# EAGLE design cupcake-heater-board (EAGLE 5.07)
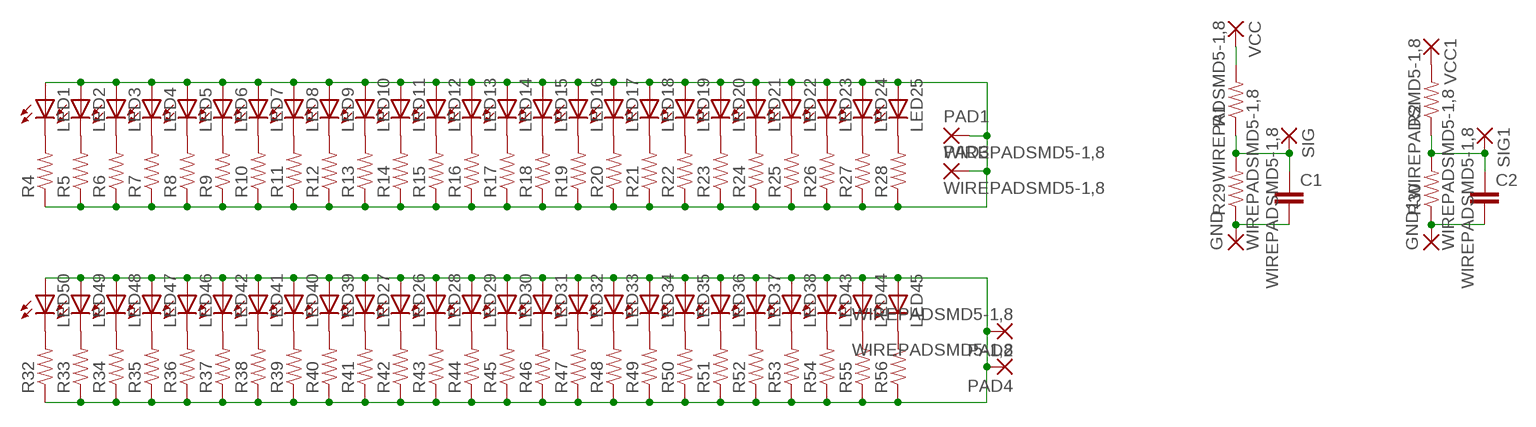
[diagram p0: schematic, sheet 1]

## Parts
C1  C-EUC1206  [C1206]
C2  C-EUC1206  [C1206]
GND  WIREPADSMD5-1,8  [5-1,8]
GND1  WIREPADSMD5-1,8  [5-1,8]
LED1  LED1206  [LED-1206]
LED2  LED1206  [LED-1206]
LED3  LED1206  [LED-1206]
LED4  LED1206  [LED-1206]
LED5  LED1206  [LED-1206]
LED6  LED1206  [LED-1206]
LED7  LED1206  [LED-1206]
LED8  LED1206  [LED-1206]
LED9  LED1206  [LED-1206]
LED10  LED1206  [LED-1206]
LED11  LED1206  [LED-1206]
LED12  LED1206  [LED-1206]
LED13  LED1206  [LED-1206]
LED14  LED1206  [LED-1206]
LED15  LED1206  [LED-1206]
LED16  LED1206  [LED-1206]
LED17  LED1206  [LED-1206]
LED18  LED1206  [LED-1206]
LED19  LED1206  [LED-1206]
LED20  LED1206  [LED-1206]
LED21  LED1206  [LED-1206]
LED22  LED1206  [LED-1206]
LED23  LED1206  [LED-1206]
LED24  LED1206  [LED-1206]
LED25  LED1206  [LED-1206]
LED26  LED1206  [LED-1206]
LED27  LED1206  [LED-1206]
LED28  LED1206  [LED-1206]
LED29  LED1206  [LED-1206]
LED30  LED1206  [LED-1206]
LED31  LED1206  [LED-1206]
LED32  LED1206  [LED-1206]
LED33  LED1206  [LED-1206]
LED34  LED1206  [LED-1206]
LED35  LED1206  [LED-1206]
LED36  LED1206  [LED-1206]
LED37  LED1206  [LED-1206]
LED38  LED1206  [LED-1206]
LED39  LED1206  [LED-1206]
LED40  LED1206  [LED-1206]
LED41  LED1206  [LED-1206]
LED42  LED1206  [LED-1206]
LED43  LED1206  [LED-1206]
LED44  LED1206  [LED-1206]
LED45  LED1206  [LED-1206]
LED46  LED1206  [LED-1206]
LED47  LED1206  [LED-1206]
LED48  LED1206  [LED-1206]
LED49  LED1206  [LED-1206]
LED50  LED1206  [LED-1206]
PAD1  WIREPADSMD5-1,8  [5-1,8]
PAD2  WIREPADSMD5-1,8  [5-1,8]
PAD3  WIREPADSMD5-1,8  [5-1,8]
PAD4  WIREPADSMD5-1,8  [5-1,8]
R1  RESISTOR1206  [1206]
R2  RESISTOR1206  [1206]
R4  RESISTOR1206  [1206]
R5  RESISTOR1206  [1206]
R6  RESISTOR1206  [1206]
R7  RESISTOR1206  [1206]
R8  RESISTOR1206  [1206]
R9  RESISTOR1206  [1206]
R10  RESISTOR1206  [1206]
R11  RESISTOR1206  [1206]
R12  RESISTOR1206  [1206]
R13  RESISTOR1206  [1206]
R14  RESISTOR1206  [1206]
R15  RESISTOR1206  [1206]
R16  RESISTOR1206  [1206]
R17  RESISTOR1206  [1206]
R18  RESISTOR1206  [1206]
R19  RESISTOR1206  [1206]
R20  RESISTOR1206  [1206]
R21  RESISTOR1206  [1206]
R22  RESISTOR1206  [1206]
R23  RESISTOR1206  [1206]
R24  RESISTOR1206  [1206]
R25  RESISTOR1206  [1206]
R26  RESISTOR1206  [1206]
R27  RESISTOR1206  [1206]
R28  RESISTOR1206  [1206]
R29  RESISTOR1206  [1206]
R30  RESISTOR1206  [1206]
R32  RESISTOR1206  [1206]
R33  RESISTOR1206  [1206]
R34  RESISTOR1206  [1206]
R35  RESISTOR1206  [1206]
R36  RESISTOR1206  [1206]
R37  RESISTOR1206  [1206]
R38  RESISTOR1206  [1206]
R39  RESISTOR1206  [1206]
R40  RESISTOR1206  [1206]
R41  RESISTOR1206  [1206]
R42  RESISTOR1206  [1206]
R43  RESISTOR1206  [1206]
R44  RESISTOR1206  [1206]
R45  RESISTOR1206  [1206]
R46  RESISTOR1206  [1206]
R47  RESISTOR1206  [1206]
R48  RESISTOR1206  [1206]
R49  RESISTOR1206  [1206]
R50  RESISTOR1206  [1206]
R51  RESISTOR1206  [1206]
R52  RESISTOR1206  [1206]
R53  RESISTOR1206  [1206]
R54  RESISTOR1206  [1206]
R55  RESISTOR1206  [1206]
R56  RESISTOR1206  [1206]
SIG  WIREPADSMD5-1,8  [5-1,8]
SIG1  WIREPADSMD5-1,8  [5-1,8]
VCC  WIREPADSMD5-1,8  [5-1,8]
VCC1  WIREPADSMD5-1,8  [5-1,8]

## Nets
N$2: LED1.C R4.2
N$3: C1.2 GND.1(P) R29.1
N$4: C1.1 R1.1 R29.2 SIG.1(P)
N$5: C2.1 R2.1 R30.2 SIG1.1(P)
N$6: C2.2 GND1.1(P) R30.1
N$7: R2.2 VCC1.1(P)
N$8: R1.2 VCC.1(P)
N$12: LED2.C R5.2
N$13: LED3.C R6.2
N$14: LED4.C R7.2
N$15: LED5.C R8.2
N$16: LED6.C R9.2
N$17: LED7.C R10.2
N$18: LED8.C R11.2
N$19: LED9.C R12.2
N$20: LED10.C R13.2
N$21: LED11.C R14.2
N$22: LED50.C R32.2
N$23: LED12.C R15.2
N$24: LED13.C R16.2
N$25: LED14.C R17.2
N$26: LED15.C R18.2
N$27: LED16.C R19.2
N$28: LED17.C R20.2
N$29: LED18.C R21.2
N$30: LED19.C R22.2
N$31: LED20.C R23.2
N$32: LED21.C R24.2
N$33: LED22.C R25.2
N$34: LED23.C R26.2
N$35: LED24.C R27.2
N$36: LED25.C R28.2
N$37: LED1.A LED2.A LED3.A LED4.A LED5.A LED6.A LED7.A LED8.A LED9.A LED10.A LED11.A LED12.A LED13.A LED14.A LED15.A LED16.A LED17.A LED18.A LED19.A LED20.A LED21.A LED22.A LED23.A LED24.A LED25.A PAD1.1(P) PAD3.1(P) R4.1 R5.1 R6.1 R7.1 R8.1 R9.1 R10.1 R11.1 R12.1 R13.1 R14.1 R15.1 R16.1 R17.1 R18.1 R19.1 R20.1 R21.1 R22.1 R23.1 R24.1 R25.1 R26.1 R27.1 R28.1
N$38: LED49.C R33.2
N$39: LED48.C R34.2
N$40: LED47.C R35.2
N$41: LED46.C R36.2
N$42: LED42.C R37.2
N$43: LED41.C R38.2
N$44: LED40.C R39.2
N$45: LED39.C R40.2
N$46: LED27.C R41.2
N$47: LED26.C R42.2
N$48: LED28.C R43.2
N$49: LED29.C R44.2
N$50: LED30.C R45.2
N$51: LED31.C R46.2
N$52: LED32.C R47.2
N$53: LED33.C R48.2
N$54: LED34.C R49.2
N$55: LED35.C R50.2
N$56: LED36.C R51.2
N$57: LED37.C R52.2
N$58: LED38.C R53.2
N$59: LED43.C R54.2
N$60: LED44.C R55.2
N$61: LED45.C R56.2
N$62: LED26.A LED27.A LED28.A LED29.A LED30.A LED31.A LED32.A LED33.A LED34.A LED35.A LED36.A LED37.A LED38.A LED39.A LED40.A LED41.A LED42.A LED43.A LED44.A LED45.A LED46.A LED47.A LED48.A LED49.A LED50.A PAD2.1(P) PAD4.1(P) R32.1 R33.1 R34.1 R35.1 R36.1 R37.1 R38.1 R39.1 R40.1 R41.1 R42.1 R43.1 R44.1 R45.1 R46.1 R47.1 R48.1 R49.1 R50.1 R51.1 R52.1 R53.1 R54.1 R55.1 R56.1

## Library data of the parts
C1 C2 = resistor:C-EU: CAPACITOR, European symbol
GND GND1 PAD1-PAD4 SIG SIG1 VCC VCC1 = wirepad:WIREPAD: Wire PAD connect wire on PCB
LED1-LED50 = SparkFun:LED: LEDs Standard schematic elements and footprints for 5mm, 3mm, 1206, and 0603 sized LEDs. 5mm - Spark Fun Electronics SKU : COM-00529 (and others)
R1 R2 R4-R30 R32-R56 = SparkFun:RESISTOR: Resistor Basic schematic elements and footprints for 0603, 1206, and PTH 1/10th watt (small) resistors.

## Board
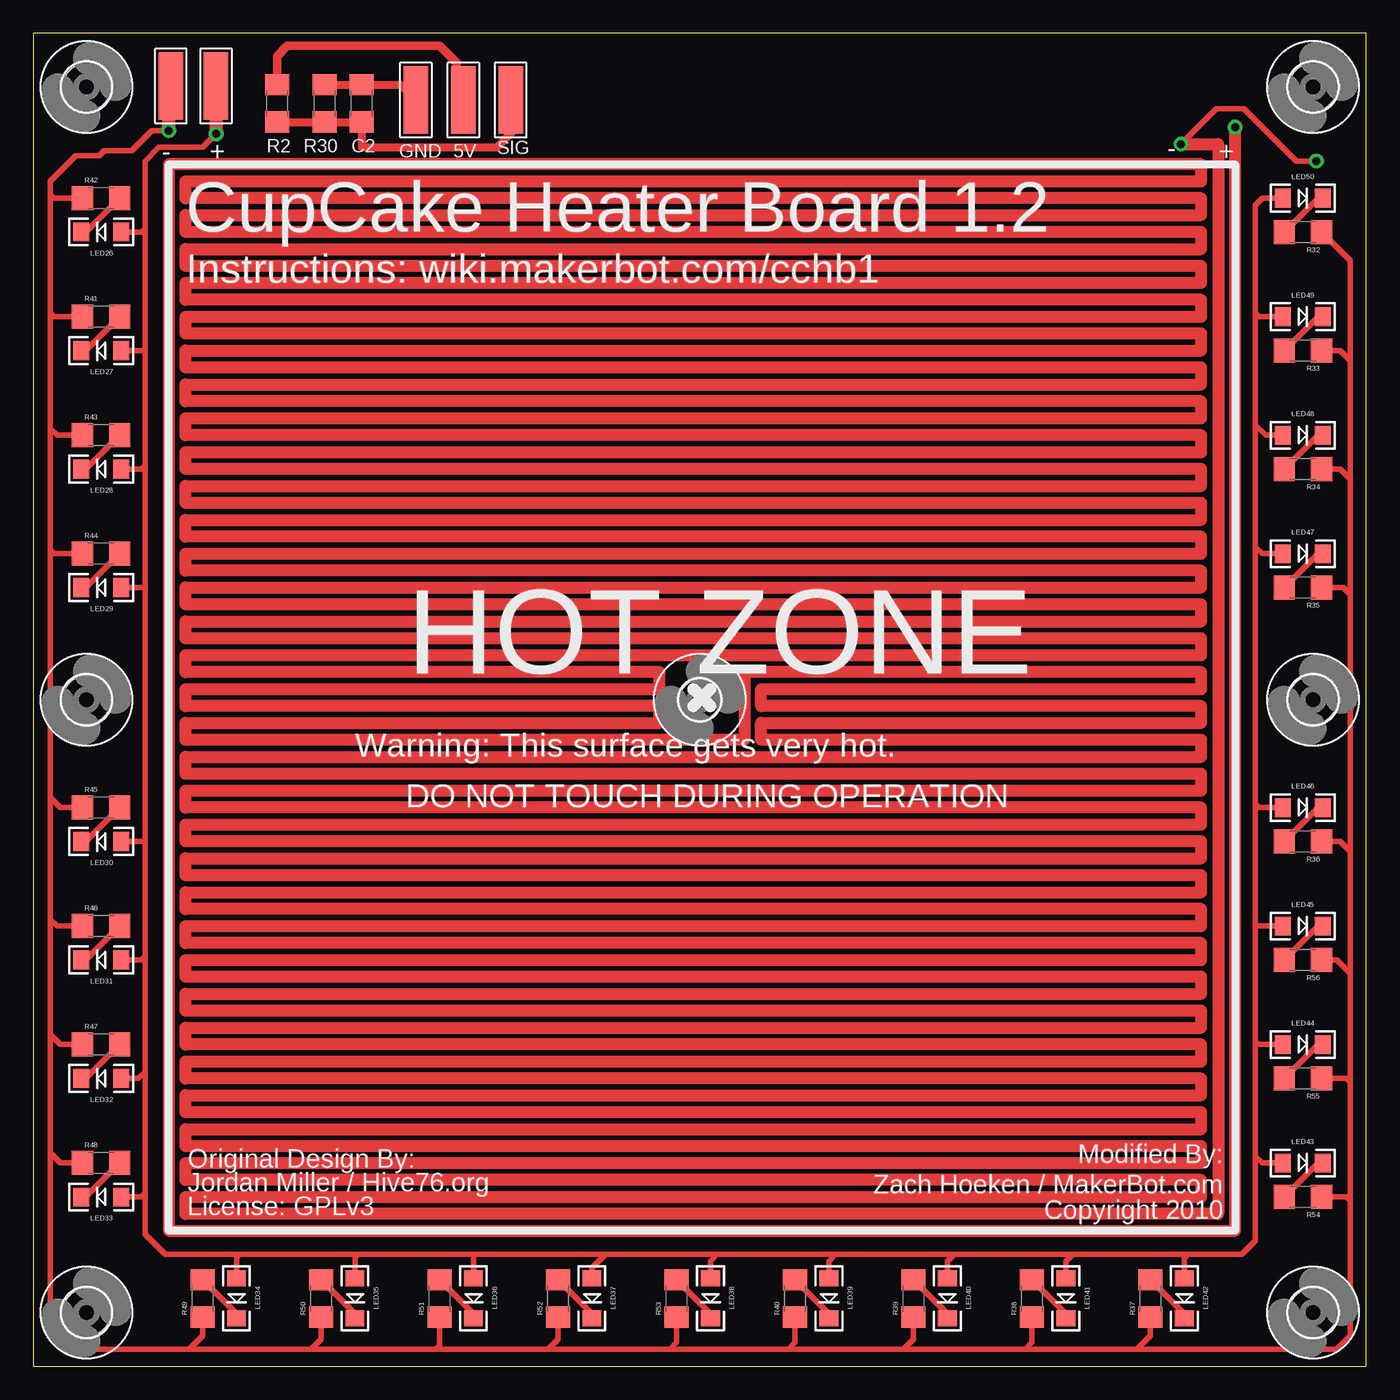
[diagram p1: board, top side]
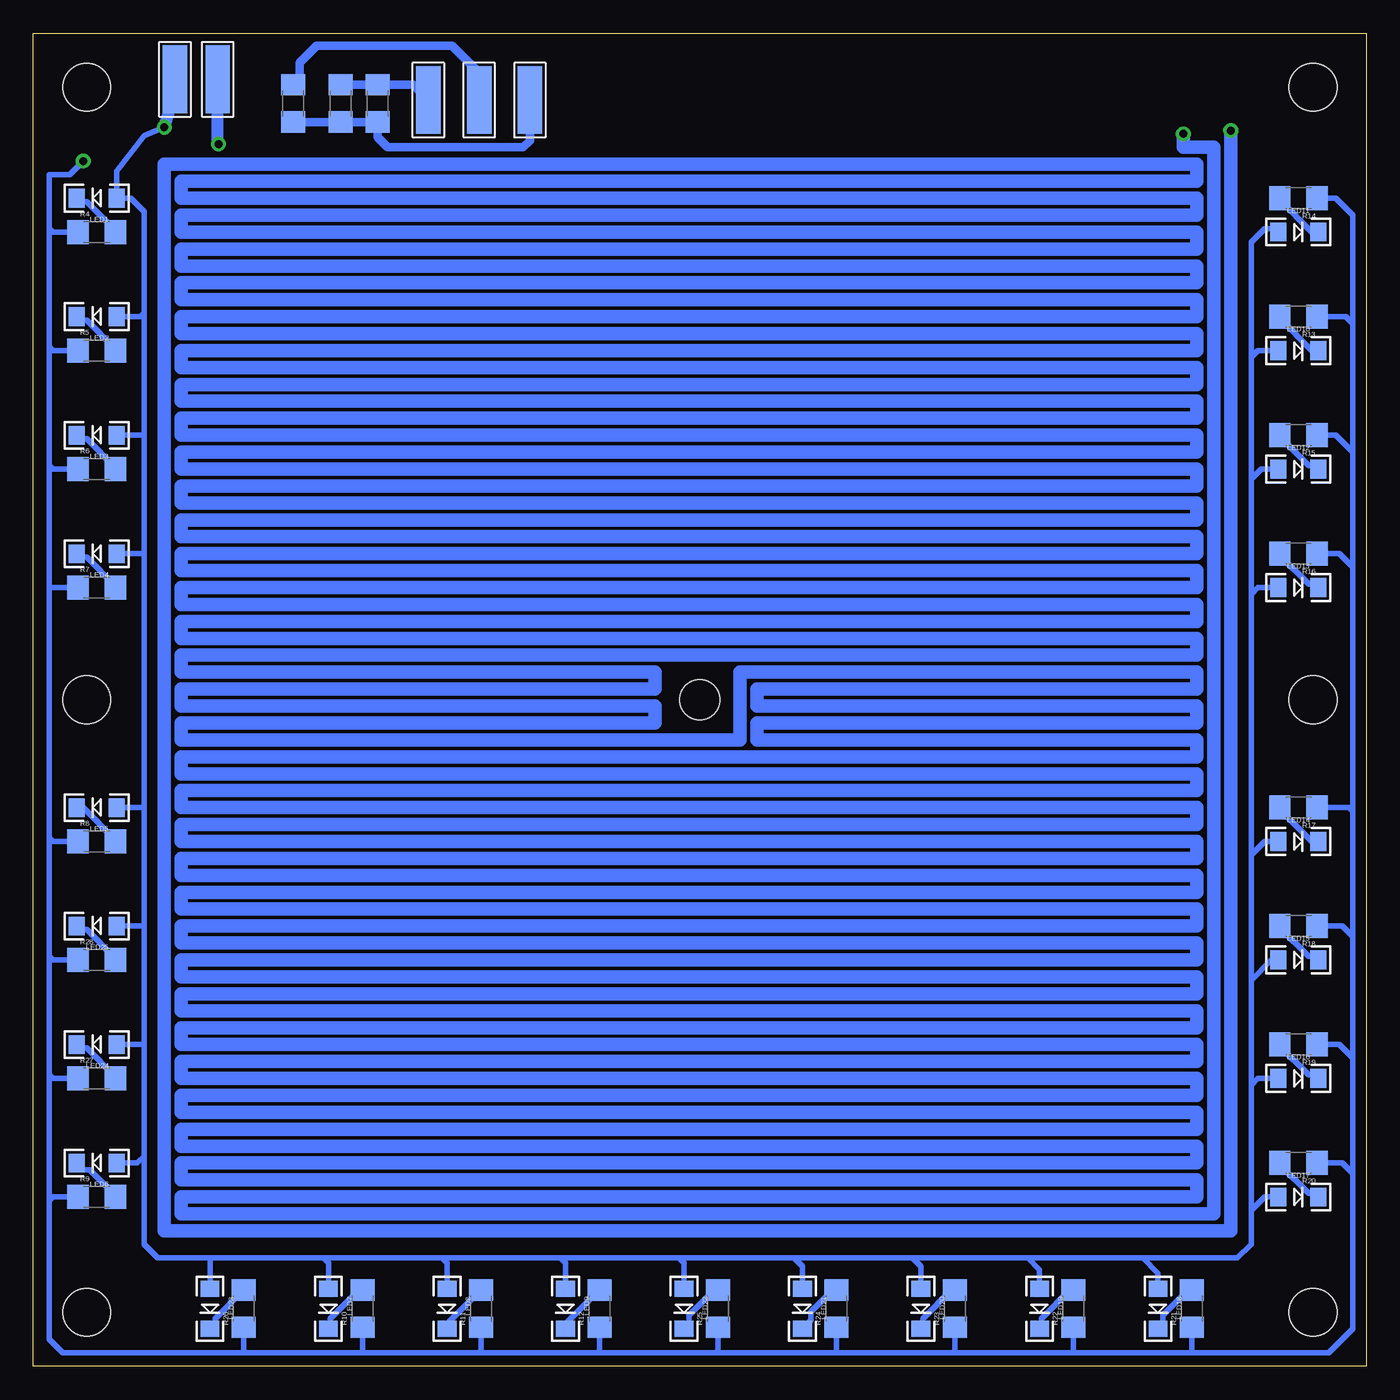
[diagram p2: board, bottom side, seen from below]

Size 100 x 100 mm. Coordinates in mm from the lower left corner, seen from the top.
Outline: 0,0 100,0 100,100 0,100 0,0
Copper layers (1*16): Top 0.035mm / dielectric 1.5mm / Bottom 0.035mm
Design rules "SparkFun": minimum track width 8mil, minimum drill 20mil, track to track 8mil, track to pad 8mil, pad to pad 8mil, via to via 8mil, smd to smd 8mil, copper to edge 10mil, drill to drill 8mil, minimum pad ring 12mil, minimum via ring 10mil, stop-mask expansion 4mil, vias tented up to drill 25mil, thermal gap 10mil

### Footprints (pad centres in the part's own frame; a part is rotated, then mirrored left to right if it is on the bottom)
C1206 = smd 1.6 x 1.8: 1 -1.4,0; 2 1.4,0
5-1,8 = smd 1.829 x 5.08: 1 0,0
LED-1206 = smd 1.2 x 1.4: A -1.5,0; C 1.5,0
1206 = smd 1.6 x 1.8: 1 -1.4,0; 2 1.4,0
3,0 = hole 3: 0,0
3,6 = hole 3.6: 0,0

### Placement (x,y rotation side)
C1  74.17,94.74 90 bottom
C2  24.64,94.74 90 top
GND  70.36,95 0 bottom
GND1  28.7,95 0 top
LED1  95.25,87.63 180 bottom
LED2  95.25,78.74 180 bottom
LED3  95.25,69.85 180 bottom
LED4  95.25,60.96 180 bottom
LED5  95.25,41.91 180 bottom
LED6  95.25,15.24 180 bottom
LED7  77.85,4.32 270 bottom
LED8  68.96,4.32 270 bottom
LED9  60.07,4.32 270 bottom
LED10  5.08,76.2 0 bottom
LED11  5.08,85.09 0 bottom
LED12  5.08,67.31 0 bottom
LED13  5.08,58.42 0 bottom
LED14  5.08,39.37 0 bottom
LED15  5.08,30.48 0 bottom
LED16  5.08,21.59 0 bottom
LED17  5.08,12.7 0 bottom
LED18  15.62,4.32 270 bottom
LED19  24.51,4.32 270 bottom
LED20  33.4,4.32 270 bottom
LED21  42.29,4.32 270 bottom
LED22  51.18,4.32 270 bottom
LED23  86.74,4.32 270 bottom
LED24  95.25,24.13 180 bottom
LED25  95.25,33.02 180 bottom
LED26  5.08,85.09 180 top
LED27  5.08,76.2 180 top
LED28  5.08,67.31 180 top
LED29  5.08,58.42 180 top
LED30  5.08,39.37 180 top
LED31  5.08,30.48 180 top
LED32  5.08,21.59 180 top
LED33  5.08,12.7 180 top
LED34  15.24,5.08 270 top
LED35  24.13,5.08 270 top
LED36  33.02,5.08 270 top
LED37  41.91,5.08 270 top
LED38  50.8,5.08 270 top
LED39  59.69,5.08 270 top
LED40  68.58,5.08 270 top
LED41  77.47,5.08 270 top
LED42  86.36,5.08 270 top
LED43  95.25,15.24 0 top
LED44  95.25,24.13 0 top
LED45  95.25,33.02 0 top
LED46  95.25,41.91 0 top
LED47  95.25,60.96 0 top
LED48  95.25,69.85 0 top
LED49  95.25,78.74 0 top
LED50  95.25,87.63 0 top
PAD1  86.17,96.55 180 bottom
PAD2  13.71,96.05 180 top
PAD3  89.38,96.55 180 bottom
PAD4  10.31,96.05 180 top
R1  80.52,94.74 90 bottom
R2  18.29,94.74 90 top
R4  95.25,85.09 0 bottom
R5  95.25,76.2 0 bottom
R6  95.25,67.31 0 bottom
R7  95.25,58.42 0 bottom
R8  95.25,39.37 0 bottom
R9  95.25,12.7 0 bottom
R10  75.31,4.32 90 bottom
R11  66.42,4.32 90 bottom
R12  57.53,4.32 90 bottom
R13  5.08,78.74 180 bottom
R14  5.08,87.63 180 bottom
R15  5.08,69.85 180 bottom
R16  5.08,60.96 180 bottom
R17  5.08,41.91 180 bottom
R18  5.08,33.02 180 bottom
R19  5.08,24.13 180 bottom
R20  5.08,15.24 180 bottom
R21  13.08,4.32 90 bottom
R22  21.97,4.32 90 bottom
R23  30.86,4.32 90 bottom
R24  39.75,4.32 90 bottom
R25  48.64,4.32 90 bottom
R26  84.2,4.32 90 bottom
R27  95.25,21.59 0 bottom
R28  95.25,30.48 0 bottom
R29  76.96,94.74 270 bottom
R30  21.84,94.74 270 top
R32  95.25,85.09 180 top
R33  95.25,76.2 180 top
R34  95.25,67.31 180 top
R35  95.25,58.42 180 top
R36  95.25,39.37 180 top
R37  83.82,5.08 90 top
R38  74.93,5.08 90 top
R39  66.04,5.08 90 top
R40  57.15,5.08 90 top
R41  5.08,78.74 0 top
R42  5.08,87.63 0 top
R43  5.08,69.85 0 top
R44  5.08,60.96 0 top
R45  5.08,41.91 0 top
R46  5.08,33.02 0 top
R47  5.08,24.13 0 top
R48  5.08,15.24 0 top
R49  12.7,5.08 90 top
R50  21.59,5.08 90 top
R51  30.48,5.08 90 top
R52  39.37,5.08 90 top
R53  48.26,5.08 90 top
R54  95.25,12.7 180 top
R55  95.25,21.59 180 top
R56  95.25,30.48 180 top
SIG  62.74,95 0 bottom
SIG1  35.81,95 0 top
U$1  [3,0]  50,50 0 top
U$2  [3,6]  4,4.04 0 top
U$3  [3,6]  4,50 0 top
U$4  [3,6]  4,95.96 0 top
U$5  [3,6]  96,95.96 0 top
U$6  [3,6]  96,50 0 top
U$7  [3,6]  96,4.04 0 top
VCC  66.55,95 0 bottom
VCC1  32.26,95 0 top

### Tracks (layer width: path | path; a pad name or v marks a point on that pad's centre or on a via)
N$2
  Bottom 0.406: R4.2 93.85,85.21 96.01,87.38 96.5,87.38 LED1.C
N$3
  Bottom 0.635: R29.1 C1.2 71.5,96.14 GND.1
N$4
  Bottom 0.635: R1.1 R29.2 C1.1 74.17,92.2 73.41,91.44 63.25,91.44 62.74,91.95 SIG.1
N$5
  Top 0.61: R2.1 R30.2 C2.1 24.64,91.44 34.8,91.44 35.81,92.46 SIG1.1
N$6
  Top 0.61: R30.1 C2.2 27.56,96.14 GND1.1
N$7
  Top 0.635: R2.2 18.29,98.3 19.05,99.06 30.48,99.06 31.75,97.79 31.75,95.5 VCC1.1
N$8
  Bottom 0.635: VCC.1 66.55,97.03 68.58,99.06 78.74,99.06 80.01,97.79 80.01,96.65 R1.2
N$12
  Bottom 0.406: R5.2 93.85,76.32 96.01,78.49 96.5,78.49 LED2.C
N$13
  Bottom 0.406: R6.2 93.85,67.43 96.01,69.6 96.5,69.6 LED3.C
N$14
  Bottom 0.406: R7.2 93.85,58.54 96.01,60.71 96.5,60.71 LED4.C
N$15
  Bottom 0.406: R8.2 93.85,39.49 96.27,41.91 LED5.C
N$16
  Bottom 0.406: R9.2 93.85,12.82 95.76,14.73 96.24,14.73 LED6.C
N$17
  Bottom 0.406: R10.2 75.56,5.72 77.72,3.56 77.72,2.94 LED7.C
N$18
  Bottom 0.406: R11.2 68.83,3.3 68.83,2.94 LED8.C
N$19
  Bottom 0.406: R12.2 59.94,3.3 59.94,2.94 LED9.C
N$20
  Bottom 0.406: R13.2 6.48,78.62 4.06,76.2 LED10.C
N$21
  Bottom 0.406: R14.2 6.48,87.51 4.06,85.09 LED11.C
N$22
  Top 0.406: LED50.C 96.39,87.63 R32.2
N$23
  Bottom 0.406: R15.2 6.48,69.73 4.32,67.56 3.83,67.56 LED12.C
N$24
  Bottom 0.406: R16.2 6.48,60.84 4.32,58.67 3.83,58.67 LED13.C
N$25
  Bottom 0.406: R17.2 6.48,41.79 4.06,39.37 LED14.C
N$26
  Bottom 0.406: R18.2 6.48,32.9 4.32,30.73 3.83,30.73 LED15.C
N$27
  Bottom 0.406: R19.2 6.48,24.01 4.32,21.84 3.83,21.84 LED16.C
N$28
  Bottom 0.406: R20.2 6.48,15.12 4.32,12.95 3.83,12.95 LED17.C
N$29
  Bottom 0.406: R21.2 13.33,5.72 15.24,3.81 15.24,3.2 LED18.C
N$30
  Bottom 0.406: R22.2 22.22,5.72 24.38,3.56 24.38,2.94 LED19.C
N$31
  Bottom 0.406: R23.2 31.11,5.72 33.27,3.56 33.27,2.94 LED20.C
N$32
  Bottom 0.406: R24.2 40,5.72 41.66,4.06 41.66,3.45 LED21.C
N$33
  Bottom 0.406: R25.2 48.89,5.72 50.8,3.81 50.8,3.2 LED22.C
N$34
  Bottom 0.406: R26.2 86.36,3.56 86.36,3.2 LED23.C
N$35
  Bottom 0.406: R27.2 93.85,21.71 96.01,23.88 96.5,23.88 LED24.C
N$36
  Bottom 0.406: R28.2 93.85,30.6 96.01,32.77 96.5,32.77 LED25.C
N$37  (via drill 0.6)
  Top 0.406: v96.27,90.42 94.74,90.42 90.81,94.36 88.77,94.36 v86.11,91.69
  Top 0.889: v90.17,92.96 90.17,10.16 10.16,10.16 10.16,90.17 87.63,90.17 87.63,88.9 11.43,88.9 11.43,87.63 87.63,87.63 87.63,86.36 11.43,86.36 11.43,85.09 87.63,85.09 87.63,83.82 11.43,83.82 11.43,82.55 87.63,82.55 87.63,81.28 11.43,81.28 11.43,80.01 87.63,80.01 87.63,78.74 11.43,78.74 11.43,77.47 87.63,77.47 87.63,76.2 11.43,76.2 11.43,74.93 87.63,74.93 87.63,73.66 11.43,73.66 11.43,72.39 87.63,72.39 87.63,71.12 11.43,71.12 11.43,69.85 87.63,69.85 87.63,68.58 11.43,68.58 11.43,67.31 87.63,67.31 87.63,66.04 11.43,66.04 11.43,64.77 87.63,64.77 87.63,63.5 11.43,63.5 11.43,62.23 87.63,62.23 87.63,60.96 11.43,60.96 11.43,59.69 87.63,59.69 87.63,58.42 11.43,58.42 11.43,57.15 87.63,57.15 87.63,55.88 11.43,55.88 11.43,54.61 87.63,54.61 87.63,53.34 11.43,53.34 11.43,52.07 46.99,52.07 46.99,50.8 11.43,50.8 11.43,49.53 46.99,49.53 46.99,48.26 11.43,48.26 11.43,46.99 53.34,46.99 53.34,52.07 87.63,52.07 87.63,50.8 54.61,50.8 54.61,49.53 87.63,49.53 87.63,48.26 54.61,48.26 54.61,46.99 87.63,46.99 87.63,45.72 11.43,45.72 11.43,44.45 87.63,44.45 87.63,43.18 11.43,43.18 11.43,41.91 87.63,41.91 87.63,40.64 11.43,40.64 11.43,39.37 87.63,39.37 87.63,38.1 11.43,38.1 11.43,36.83 87.63,36.83 87.63,35.56 11.43,35.56 11.43,34.29 87.63,34.29 87.63,33.02 11.43,33.02 11.43,31.75 87.63,31.75 87.63,30.48 11.43,30.48 11.43,29.21 87.63,29.21 87.63,27.94 11.43,27.94 11.43,26.67 87.63,26.67 87.63,25.4 11.43,25.4 11.43,24.13 87.63,24.13 87.63,22.86 11.43,22.86 11.43,21.59 87.63,21.59 87.63,20.32 11.43,20.32 11.43,19.05 87.63,19.05 87.63,17.78 11.43,17.78 11.43,16.51 87.63,16.51 87.63,15.24 11.43,15.24 11.43,13.97 87.63,13.97 87.63,12.7 11.43,12.7 11.43,11.43 88.9,11.43 88.9,91.69 v86.11,91.69
  Bottom 0.406: 97.54,85.09 R4.1 98.55,85.09 98.81,85.34 | 98.81,12.45 98.81,2.03 97.79,1.02 84.07,1.02 | 98.81,12.45 98.81,21.84 | 98.81,21.84 98.81,30.73 | 98.81,30.73 98.81,39.62 | 98.81,39.62 98.81,58.42 | 98.81,58.42 98.81,67.56 | 98.81,67.56 98.81,76.45 | 13.21,1.02 2.79,1.02 1.02,2.79 1.02,14.48 | 13.21,1.02 21.84,1.02 | 21.84,1.02 30.99,1.02 | 30.99,1.02 39.62,1.02 | 39.62,1.02 48.77,1.02 | 48.77,1.02 57.66,1.02 | 57.66,1.02 66.55,1.02 | 66.55,1.02 75.18,1.02 | 75.18,1.02 84.07,1.02 | 1.02,14.48 1.02,23.11 | 1.02,23.11 1.02,32.26 | 1.02,32.26 1.02,41.66 | 1.02,41.66 1.02,59.94 | 1.02,59.94 1.02,68.58 | 1.02,68.58 1.02,78.23 | 1.02,78.23 1.02,86.36 2.29,87.63 R14.1 | R13.1 1.52,78.74 1.02,78.23 | R15.1 2.29,69.85 1.02,68.58 | R16.1 2.03,60.96 1.02,59.94 | R17.1 1.27,41.91 1.02,41.66 | R18.1 1.78,33.02 1.02,32.26 | R19.1 2.03,24.13 1.02,23.11 | R20.1 1.78,15.24 1.02,14.48 | R21.1 13.08,1.14 13.21,1.02 | R22.1 21.97,1.14 21.84,1.02 | R23.1 30.86,1.14 30.99,1.02 | R24.1 39.75,1.14 39.62,1.02 | R25.1 48.64,1.14 48.77,1.02 | R12.1 57.53,1.14 57.66,1.02 | R11.1 66.42,1.14 66.55,1.02 | R10.1 75.31,1.14 75.18,1.02 | R26.1 84.2,1.14 84.07,1.02 | R9.1 98.55,12.7 98.81,12.45 | R27.1 98.55,21.59 98.81,21.84 | R28.1 98.55,30.48 98.81,30.73 | R8.1 98.55,39.37 98.81,39.62 | 98.81,58.42 R7.1 | R6.1 98.55,67.31 98.81,67.56 | R5.1 98.55,76.2 98.81,76.45 | 91.69,15.75 91.69,9.14 90.68,8.13 86.87,8.13 | 91.69,24.13 91.69,15.75 | 91.69,33.02 91.69,24.13 | 91.69,41.91 91.69,33.02 | 91.69,60.96 91.69,41.91 | 91.69,69.85 91.69,60.96 | 91.69,78.99 91.69,69.85 | 91.69,78.99 91.69,86.61 92.71,87.63 LED1.A 93.75,89.64 91.69,92.33 v90.17,92.96 | 16.76,8.13 9.65,8.13 8.64,9.14 8.64,11.68
  Bottom 0.406: 25.4,8.13 16.76,8.13 | 34.04,8.13 25.4,8.13 | 42.93,8.13 34.04,8.13 | 51.56,8.13 42.93,8.13 | 60.45,8.13 51.56,8.13 | 69.34,8.13 60.45,8.13 | 78.23,8.13 69.34,8.13 | 86.87,8.13 78.23,8.13 | 8.64,11.68 8.64,21.08 | 8.64,21.08 8.64,28.96 | 8.64,28.96 8.64,38.35 | 8.64,38.35 8.64,57.91 | 8.64,57.91 8.64,66.55 | 8.64,66.55 8.64,75.69 | 8.64,75.69 8.64,84.33 7.62,85.34 6.83,85.34 LED11.A | LED10.A 8.13,76.2 8.64,75.69 | LED12.A 7.87,67.31 8.64,66.55 | LED13.A 8.13,58.42 8.64,57.91 | LED14.A 7.62,39.37 8.64,38.35 | LED15.A 7.11,30.48 8.64,28.96 | LED16.A 8.13,21.59 8.64,21.08 | LED17.A 7.62,12.7 8.64,11.68 | LED18.A 15.62,6.99 16.76,8.13 | LED19.A 24.51,7.24 25.4,8.13 | LED20.A 33.4,7.49 34.04,8.13 | LED21.A 42.29,7.49 42.93,8.13 | LED22.A 51.18,7.75 51.56,8.13 | LED9.A 60.07,7.75 60.45,8.13 | LED8.A 68.96,7.75 69.34,8.13 | LED7.A 77.85,7.75 78.23,8.13 | LED23.A 86.74,8 86.87,8.13 | LED6.A 92.2,15.24 91.69,15.75 | 91.69,24.13 LED24.A | 91.69,33.02 LED25.A | 91.69,41.91 LED5.A | 91.69,60.96 LED4.A | 91.69,69.85 LED3.A | LED2.A 91.95,78.74 91.69,78.99 | 98.81,76.45 98.81,85.34 | 98.81,85.34 98.81,89.41 97.28,89.41 v96.27,90.42
  Bottom 0.635: 89.38,95.66 PAD3.1 | PAD1.1 86.29,95.16
  Bottom 0.889: v90.17,92.96 89.38,95.66 | v86.11,91.69 86.17,91.69 PAD1.1
N$38
  Top 0.406: LED49.C 96.39,78.74 R33.2
N$39
  Top 0.406: LED48.C 96.39,69.85 R34.2
N$40
  Top 0.406: LED47.C 96.39,60.96 R35.2
N$41
  Top 0.406: LED46.C 96.39,41.91 R36.2
N$42
  Top 0.406: LED42.C 86.36,3.94 R37.2
N$43
  Top 0.406: LED41.C 77.47,3.94 R38.2
N$44
  Top 0.406: LED40.C 68.58,3.94 R39.2
N$45
  Top 0.406: LED39.C 59.69,3.94 R40.2
N$46
  Top 0.406: LED27.C 3.94,76.2 R41.2
N$47
  Top 0.406: LED26.C 3.94,85.09 R42.2
N$48
  Top 0.406: LED28.C 3.94,67.31 R43.2
N$49
  Top 0.406: LED29.C 3.94,58.42 R44.2
N$50
  Top 0.406: LED30.C 3.94,39.37 R45.2
N$51
  Top 0.406: LED31.C 3.94,30.48 R46.2
N$52
  Top 0.406: LED32.C 3.94,21.59 R47.2
N$53
  Top 0.406: LED33.C 3.94,12.7 R48.2
N$54
  Top 0.406: LED34.C 15.24,3.94 R49.2
N$55
  Top 0.406: LED35.C 24.13,3.94 R50.2
N$56
  Top 0.406: LED36.C 33.02,3.94 R51.2
N$57
  Top 0.406: LED37.C 41.91,3.94 R52.2
N$58
  Top 0.406: LED38.C 50.8,3.94 R53.2
N$59
  Top 0.406: LED43.C 96.39,15.24 R54.2
N$60
  Top 0.406: LED44.C 96.39,24.13 R55.2
N$61
  Top 0.406: LED45.C 96.39,33.02 R56.2
N$62  (via drill 0.6)
  Top 0.406: v10.16,92.71 8.89,92.71 7.37,91.19 5.33,91.19 4.95,90.8 3.17,90.8 1.27,88.9 1.27,87.88 | v13.72,92.46 12.7,91.44 9.4,91.44 8.38,90.42 8.38,85.34 | 1.27,16 1.27,2.29 2.29,1.27 11.68,1.27 | 1.27,16 1.27,24.89 | 1.27,24.89 1.27,33.53 | 1.27,33.53 1.27,42.67 | 1.27,42.67 1.27,61.21 | 1.27,61.21 1.27,70.36 | 1.27,70.36 1.27,78.99 | 1.27,78.99 1.27,87.88 | 11.68,1.27 20.83,1.27 | 20.83,1.27 30.23,1.27 | 30.23,1.27 38.61,1.27 | 38.61,1.27 47.75,1.27 | 47.75,1.27 56.64,1.27 | 56.64,1.27 65.28,1.27 | 65.28,1.27 74.42,1.27 | 74.42,1.27 82.8,1.27 | 82.8,1.27 97.79,1.27 98.81,2.29 98.81,12.45 | 98.81,12.45 98.81,21.34 | 98.81,21.34 98.81,29.46 | 98.81,29.46 98.81,38.61 | 98.81,38.61 98.81,57.91 | 98.81,57.91 98.81,66.55 | 98.81,66.55 98.81,75.44 | 98.81,75.44 98.81,82.93 R32.1 | LED50.A 92.2,87.63 91.69,87.12 91.69,78.99 | 91.69,15.75 91.69,9.4 90.68,8.38 86.61,8.38 | 91.69,15.75 91.69,24.38 | 91.69,24.38 91.69,33.02 | 91.69,33.02 91.69,42.16 | 91.69,42.16 91.69,61.47 | 91.69,61.47 91.69,70.61 | 91.69,70.61 91.69,78.99 | 15.49,8.38 9.91,8.38 8.38,9.91 8.38,12.95 | 15.49,8.38 24.38,8.38 | 24.38,8.38 33.02,8.38 | 33.02,8.38 42.93,8.38 | 42.93,8.38 51.31,8.38 | 51.31,8.38 60.2,8.38 | 60.2,8.38 69.09,8.38 | 69.09,8.38 77.98,8.38 | 77.98,8.38 86.61,8.38 | 8.38,22.1 8.38,12.95 | 8.38,30.73 8.38,22.1 | 8.38,39.37 8.38,30.73 | 8.38,58.42 8.38,39.37 | 8.38,67.56 8.38,58.42 | 8.38,76.2 8.38,67.56 | 8.38,85.34 8.38,76.2 | LED26.A 8.13,85.09 8.38,85.34 | 8.38,76.2 LED27.A | LED28.A 8.13,67.31 8.38,67.56 | 8.38,58.42 LED29.A | 8.38,39.37 LED30.A | LED31.A 8.13,30.48 8.38,30.73 | LED32.A 7.87,21.59 8.38,22.1 | LED33.A 8.13,12.7 8.38,12.95 | LED34.A 15.24,8.13 15.49,8.38 | LED35.A 24.13,8.13 24.38,8.38
  Top 0.406: 33.02,8.38 LED36.A | LED37.A 41.91,7.37 42.93,8.38 | LED38.A 50.8,7.87 51.31,8.38 | LED39.A 59.69,7.87 60.2,8.38 | LED40.A 68.58,7.87 69.09,8.38 | LED41.A 77.47,7.87 77.98,8.38 | LED42.A 86.36,8.13 86.61,8.38 | LED43.A 92.2,15.24 91.69,15.75 | LED44.A 91.95,24.13 91.69,24.38 | 91.69,33.02 LED45.A | LED46.A 91.95,41.91 91.69,42.16 | LED47.A 92.2,60.96 91.69,61.47 | LED48.A 92.46,69.85 91.69,70.61 | LED49.A 91.95,78.74 91.69,78.99 | R33.1 98.04,76.2 98.81,75.44 | R34.1 98.04,67.31 98.81,66.55 | R35.1 98.3,58.42 98.81,57.91 | R36.1 98.04,39.37 98.81,38.61 | R56.1 97.79,30.48 98.81,29.46 | R55.1 98.55,21.59 98.81,21.34 | R54.1 98.55,12.7 98.81,12.45 | R37.1 83.82,2.29 82.8,1.27 | R38.1 74.93,1.78 74.42,1.27 | R39.1 66.04,2.03 65.28,1.27 | R40.1 57.15,1.78 56.64,1.27 | R53.1 48.26,1.78 47.75,1.27 | R52.1 39.37,2.03 38.61,1.27 | R51.1 30.48,1.52 30.23,1.27 | R50.1 21.59,2.03 20.83,1.27 | R49.1 12.7,2.29 11.68,1.27 | R48.1 2.03,15.24 1.27,16 | R47.1 2.03,24.13 1.27,24.89 | R46.1 1.78,33.02 1.27,33.53 | R45.1 2.03,41.91 1.27,42.67 | R44.1 1.52,60.96 1.27,61.21 | R43.1 1.78,69.85 1.27,70.36 | R41.1 1.52,78.74 1.27,78.99 | R42.1 1.52,87.63 1.27,87.88
  Top 0.61: PAD2.1 13.74,98.04
  Top 0.762: 10.16,96.05 PAD4.1 | 13.72,95.25 PAD2.1
  Top 1.016: v10.16,92.71 10.16,96.05 | v13.72,92.46 13.72,95.25
  Bottom 1.016: v13.72,92.46 v13.71,92.45 13.71,91.44 11.43,91.44 11.43,11.43 88.9,11.43 88.9,12.7 12.7,12.7 12.7,13.97 88.9,13.97 88.9,15.24 12.7,15.24 12.7,16.51 88.9,16.51 88.9,17.78 12.7,17.78 12.7,19.05 88.9,19.05 88.9,20.32 12.7,20.32 12.7,21.59 88.9,21.59 88.9,22.86 12.7,22.86 12.7,24.13 88.9,24.13 88.9,25.4 12.7,25.4 12.7,26.67 88.9,26.67 88.9,27.94 12.7,27.94 12.7,29.21 88.9,29.21 88.9,30.48 12.7,30.48 12.7,31.75 88.9,31.75 88.9,33.02 12.7,33.02 12.7,34.29 88.9,34.29 88.9,35.56 12.7,35.56 12.7,36.83 88.9,36.83 88.9,38.1 12.7,38.1 12.7,39.37 88.9,39.37 88.9,40.64 12.7,40.64 12.7,41.91 88.9,41.91 88.9,43.18 12.7,43.18 12.7,44.45 88.9,44.45 88.9,45.72 12.7,45.72 12.7,46.99 45.72,46.99 45.72,48.26 12.7,48.26 12.7,49.53 45.72,49.53 45.72,50.8 12.7,50.8 12.7,52.07 46.99,52.07 46.99,46.99 88.9,46.99 88.9,48.26 53.34,48.26 53.34,49.53 88.9,49.53 88.9,50.8 53.34,50.8 53.34,52.07 88.9,52.07 88.9,53.34 12.7,53.34 12.7,54.61 88.9,54.61 88.9,55.88 12.7,55.88 12.7,57.15 88.9,57.15 88.9,58.42 12.7,58.42 12.7,59.69 88.9,59.69 88.9,60.96 12.7,60.96 12.7,62.23 88.9,62.23 88.9,63.5 12.7,63.5 12.7,64.77 88.9,64.77 88.9,66.04 12.7,66.04 12.7,67.31 88.9,67.31 88.9,68.58 12.7,68.58 12.7,69.85 88.9,69.85 88.9,71.12 12.7,71.12 12.7,72.39 88.9,72.39 88.9,73.66 12.7,73.66 12.7,74.93 88.9,74.93 88.9,76.2 12.7,76.2 12.7,77.47 88.9,77.47 88.9,78.74 12.7,78.74 12.7,80.01 88.9,80.01 88.9,81.28 12.7,81.28 12.7,82.55 88.9,82.55 88.9,83.82 12.7,83.82 12.7,85.09 88.9,85.09 88.9,86.36 12.7,86.36 12.7,87.63 88.9,87.63 88.9,88.9 12.7,88.9 12.7,90.17 90.17,90.17 90.17,10.16 10.16,10.16 v10.16,92.71

### Text on the board
tPlace: GND | 5V | SIG | - | - | + | + | CupCake Heater Board 1.2 | Instructions: wiki.makerbot.com/cchb1 | HOT ZONE | Warning: This surface gets very hot. | DO NOT TOUCH DURING OPERATION | Modified By: | Original Design By: | Zach Hoeken / MakerBot.com | Jordan Miller / Hive76.org | Copyright 2010 | License: GPLv3